# EAGLE design PiHatSandwich-v1 (EAGLE 7.4.0)
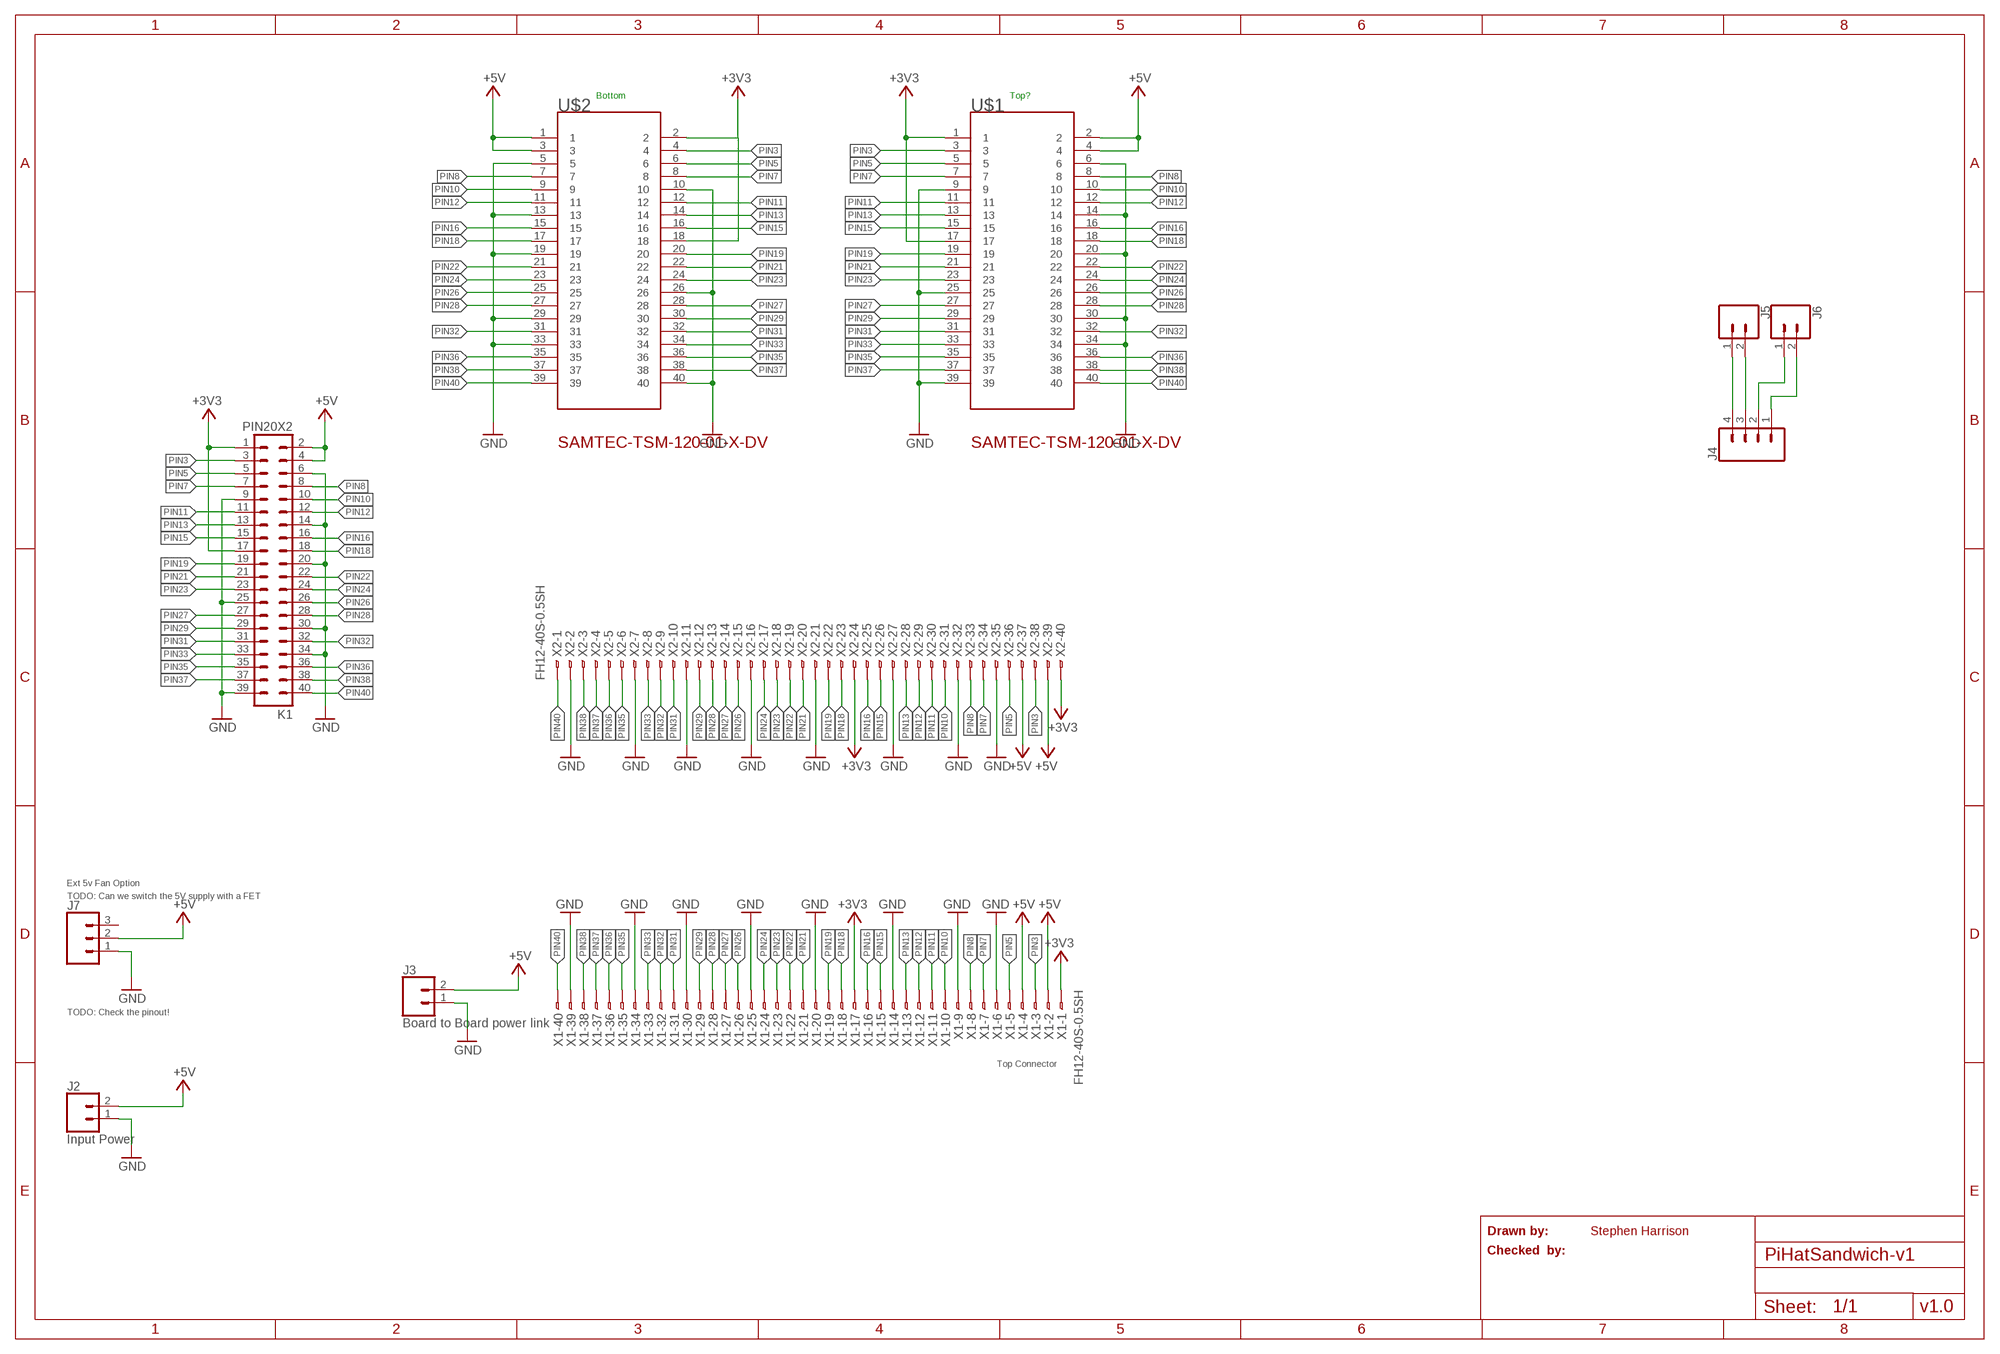
[diagram p0: schematic, sheet 1]

## Parts
J2  Input Power  CONN_02POLAR  [MOLEX-1X2]
J3  Board to Board power link  CONN_02POLAR  [MOLEX-1X2]
J4  CONN_04POLAR  [MOLEX-1X4]
J5  CONN_02  [1X02]
J6  CONN_02  [1X02]
J7  CONN_03POLAR  [MOLEX-1X3]
K1  PIN20X2  [PIN_20X2]
U$1  SAMTEC-TSM-120-01-X-DVJ  [SAMTEC-TSM-120-01-X-DV]
U$2  SAMTEC-TSM-120-01-X-DVJ  [SAMTEC-TSM-120-01-X-DV]
X1  FH12-40S-0.5SH  [FH12-40S-0.5SH]
X2  FH12-40S-0.5SH  [FH12-40S-0.5SH]

## Nets
+3V3: K1.1 K1.17 U$1.1 U$1.17 U$2.2 U$2.18 X1.1 X1.17 X2.24 X2.40
+5V: J2.2 J3.2 J7.2 K1.2 K1.4 U$1.2 U$1.4 U$2.1 U$2.3 X1.2 X1.4 X2.37 X2.39
GND: J2.1 J3.1 J7.1 K1.6 K1.9 K1.14 K1.20 K1.25 K1.30 K1.34 K1.39 U$1.6 U$1.9 U$1.14 U$1.20 U$1.25 U$1.30 U$1.34 U$1.39 U$2.5 U$2.10 U$2.13 U$2.19 U$2.26 U$2.29 U$2.33 U$2.40 X1.6 X1.9 X1.14 X1.20 X1.25 X1.30 X1.34 X1.39 X2.2 X2.7 X2.11 X2.16 X2.21 X2.27 X2.32 X2.35
N$4: J4.4 J5.1
N$5: J4.3 J5.2
N$6: J4.1 J6.2
N$7: J4.2 J6.1
PIN3: K1.3 U$1.3 U$2.4 X1.3 X2.38
PIN5: K1.5 U$1.5 U$2.6 X1.5 X2.36
PIN7: K1.7 U$1.7 U$2.8 X1.7 X2.34
PIN8: K1.8 U$1.8 U$2.7 X1.8 X2.33
PIN10: K1.10 U$1.10 U$2.9 X1.10 X2.31
PIN11: K1.11 U$1.11 U$2.12 X1.11 X2.30
PIN12: K1.12 U$1.12 U$2.11 X1.12 X2.29
PIN13: K1.13 U$1.13 U$2.14 X1.13 X2.28
PIN15: K1.15 U$1.15 U$2.16 X1.15 X2.26
PIN16: K1.16 U$1.16 U$2.15 X1.16 X2.25
PIN18: K1.18 U$1.18 U$2.17 X1.18 X2.23
PIN19: K1.19 U$1.19 U$2.20 X1.19 X2.22
PIN21: K1.21 U$1.21 U$2.22 X1.21 X2.20
PIN22: K1.22 U$1.22 U$2.21 X1.22 X2.19
PIN23: K1.23 U$1.23 U$2.24 X1.23 X2.18
PIN24: K1.24 U$1.24 U$2.23 X1.24 X2.17
PIN26: K1.26 U$1.26 U$2.25 X1.26 X2.15
PIN27: K1.27 U$1.27 U$2.28 X1.27 X2.14
PIN28: K1.28 U$1.28 U$2.27 X1.28 X2.13
PIN29: K1.29 U$1.29 U$2.30 X1.29 X2.12
PIN31: K1.31 U$1.31 U$2.32 X1.31 X2.10
PIN32: K1.32 U$1.32 U$2.31 X1.32 X2.9
PIN33: K1.33 U$1.33 U$2.34 X1.33 X2.8
PIN35: K1.35 U$1.35 U$2.36 X1.35 X2.6
PIN36: K1.36 U$1.36 U$2.35 X1.36 X2.5
PIN37: K1.37 U$1.37 U$2.38 X1.37 X2.4
PIN38: K1.38 U$1.38 U$2.37 X1.38 X2.3
PIN40: K1.40 U$1.40 U$2.39 X1.40 X2.1
Unconnected: J7.3

## Notes on the sheet
- Bottom | Top?
- Ext 5v Fan Option
- TODO: Can we switch the 5V supply with a FET
- TODO: Check the pinout!
- Top Connector
- Drawn by: | Stephen Harrison
- Checked  by:
- v1.0

## Library data of the parts
J2 J3 = SparkFun-Connectors:CONN_02: Multi connection point. Often used as Generic Header-pin footprint for 0.1 inch spaced/style header connections On any of the 0.1 inch spaced packages, you can populate with these: Break Away Headers - Straight <https://www.sparkfun.com/products/116> (PRT-00116) Break Away Male Headers - Right Angle <https://www.sparkfun.com/products/553> (PRT-00553) Female Headers <https://www.sparkfun.com/products/115> (PRT-00115) Break Away Headers - Machine Pin <https://www.sparkfun.com/products/117> (PRT-00117) Break Away Female Headers - Swiss Machine Pin <https://www.sparkfun.com/products/743> (PRT-00743) For SCREWTERMINALS and SPRING TERMINALS visit here: Screw Terimnals on SparkFun.com <https://www.sparkfun.com/search/results?term=Screw+Terminals> (5mm/3.5mm/2.54mm spacing) This device is also useful as a general connection point to wire up your design to another part of your project. Our various solder wires solder well into these plated through hole pads. Hook-Up Wire - Assortment (Stranded, 22 AWG) <https://www.sparkfun.com/products/11375> (PRT-11375) Hook-Up Wire - Assortment (Solid Core, 22 AWG) <https://www.sparkfun.com/products/11367> (PRT-11367) View the entire wire category on our website here <https://www.sparkfun.com/categories/141> Special notes: Molex polarized connector foot print use with: PRT-08233 with associated crimp pins and housings. 2.54_SCREWTERM for use with PRT-10571. 3.5mm Screw Terminal footprints for PRT-08084 5mm Screw Terminal footprints for use with PRT-08432; SF_ID: PRT-09918
J4 = SparkFun-Connectors:CONN_04: Multi connection point. Often used as Generic Header-pin footprint for 0.1 inch spaced/style header connections On any of the 0.1 inch spaced packages, you can populate with these: Break Away Headers - Straight <https://www.sparkfun.com/products/116> (PRT-00116) Break Away Male Headers - Right Angle <https://www.sparkfun.com/products/553> (PRT-00553) Female Headers <https://www.sparkfun.com/products/115> (PRT-00115) Break Away Headers - Machine Pin <https://www.sparkfun.com/products/117> (PRT-00117) Break Away Female Headers - Swiss Machine Pin <https://www.sparkfun.com/products/743> (PRT-00743) For SCREWTERMINALS and SPRING TERMINALS visit here: Screw Terimnals on SparkFun.com <https://www.sparkfun.com/search/results?term=Screw+Terminals> (5mm/3.5mm/2.54mm spacing) This device is also useful as a general connection point to wire up your design to another part of your project. Our various solder wires solder well into these plated through hole pads. Hook-Up Wire - Assortment (Stranded, 22 AWG) <https://www.sparkfun.com/products/11375> (PRT-11375) Hook-Up Wire - Assortment (Solid Core, 22 AWG) <https://www.sparkfun.com/products/11367> (PRT-11367) View the entire wire category on our website here <https://www.sparkfun.com/categories/141> Special notes: Molex polarized connector foot print use with SKU : PRT-08231 with associated crimp pins and housings. 1MM SMD Version SKU: PRT-10208; PROD_ID: CONN-08186; SF_ID: PRT-08231
J5 J6 = SparkFun-Connectors:CONN_02: Multi connection point. Often used as Generic Header-pin footprint for 0.1 inch spaced/style header connections On any of the 0.1 inch spaced packages, you can populate with these: Break Away Headers - Straight <https://www.sparkfun.com/products/116> (PRT-00116) Break Away Male Headers - Right Angle <https://www.sparkfun.com/products/553> (PRT-00553) Female Headers <https://www.sparkfun.com/products/115> (PRT-00115) Break Away Headers - Machine Pin <https://www.sparkfun.com/products/117> (PRT-00117) Break Away Female Headers - Swiss Machine Pin <https://www.sparkfun.com/products/743> (PRT-00743) For SCREWTERMINALS and SPRING TERMINALS visit here: Screw Terimnals on SparkFun.com <https://www.sparkfun.com/search/results?term=Screw+Terminals> (5mm/3.5mm/2.54mm spacing) This device is also useful as a general connection point to wire up your design to another part of your project. Our various solder wires solder well into these plated through hole pads. Hook-Up Wire - Assortment (Stranded, 22 AWG) <https://www.sparkfun.com/products/11375> (PRT-11375) Hook-Up Wire - Assortment (Solid Core, 22 AWG) <https://www.sparkfun.com/products/11367> (PRT-11367) View the entire wire category on our website here <https://www.sparkfun.com/categories/141> Special notes: Molex polarized connector foot print use with: PRT-08233 with associated crimp pins and housings. 2.54_SCREWTERM for use with PRT-10571. 3.5mm Screw Terminal footprints for PRT-08084 5mm Screw Terminal footprints for use with PRT-08432
J7 = SparkFun-Connectors:CONN_03: Multi connection point. Often used as Generic Header-pin footprint for 0.1 inch spaced/style header connections On any of the 0.1 inch spaced packages, you can populate with these: Break Away Headers - Straight <https://www.sparkfun.com/products/116> (PRT-00116) Break Away Male Headers - Right Angle <https://www.sparkfun.com/products/553> (PRT-00553) Female Headers <https://www.sparkfun.com/products/115> (PRT-00115) Break Away Headers - Machine Pin <https://www.sparkfun.com/products/117> (PRT-00117) Break Away Female Headers - Swiss Machine Pin <https://www.sparkfun.com/products/743> (PRT-00743) Stackable Header - 3 Pin (Female, 0.1") <https://www.sparkfun.com/products/13875> (PRT-13875) For SCREWTERMINALS and SPRING TERMINALS visit here: Screw Terimnals on SparkFun.com <https://www.sparkfun.com/search/results?term=Screw+Terminals> (5mm/3.5mm/2.54mm spacing) This device is also useful as a general connection point to wire up your design to another part of your project. Our various solder wires solder well into these plated through hole pads. Hook-Up Wire - Assortment (Stranded, 22 AWG) <https://www.sparkfun.com/products/11375> (PRT-11375) Hook-Up Wire - Assortment (Solid Core, 22 AWG) <https://www.sparkfun.com/products/11367> (PRT-11367) View the entire wire category on our website here <https://www.sparkfun.com/categories/141> Special notes: Molex polarized connector foot print use with SKU : PRT-08232 with associated crimp pins and housings.; PROD_ID: CONN-08625; SF_ID: PRT-08096
K1 = FLYFISH:PIN20X2
U$1 U$2 = SAMTEC-TSM-120-01-X-DV:SAMTEC-TSM-120-01-X-DV; AVAILABILITY: Unavailable; DESCRIPTION: Conn Unshrouded Header HDR 40 POS 2.54mm Solder ST SMD Tube; MF: Samtec; MP: TSM-120-01-S-DV-M; PACKAGE: None; PRICE: None
X1 X2 = con-hirose:FH12-40S-0.5S: 0.5mm Pitch Connectors For FPC/FFC Source: Data sheet <http://www.hirose.co.jp/cataloge_hp/e58605370.pdf>; MPN: FH12-40S-0.5SH(55); OC_FARNELL: 1324556; OC_NEWARK: 34M6178

## Board
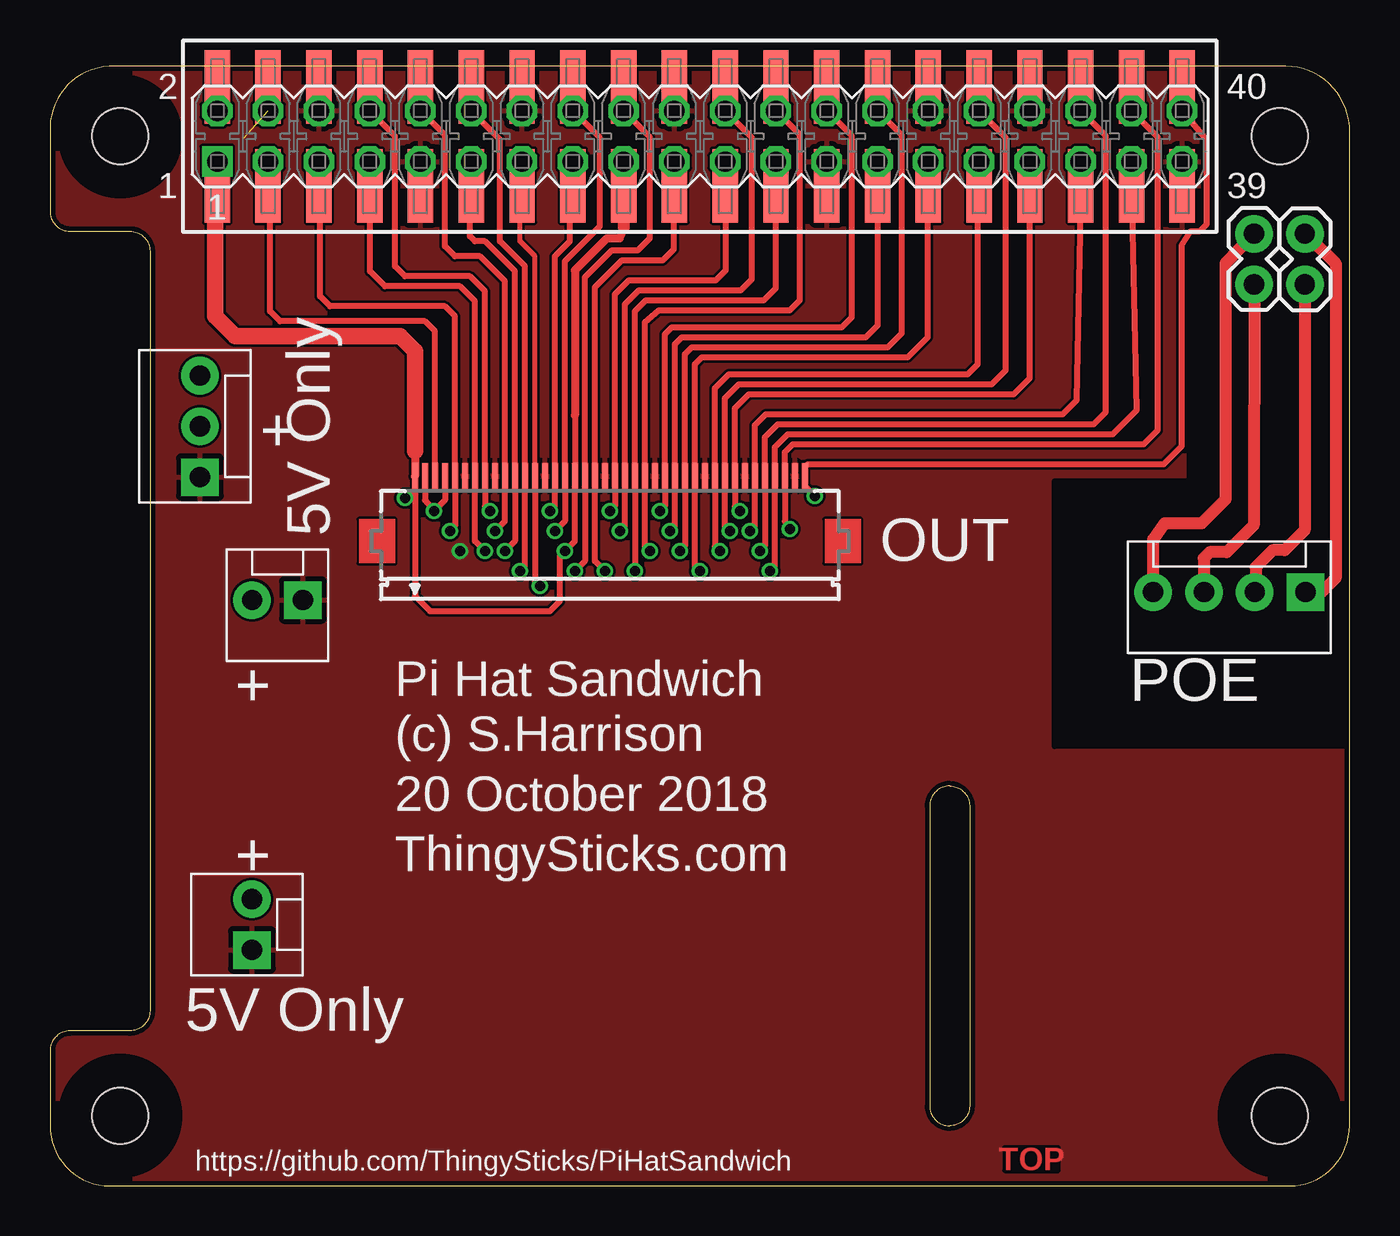
[diagram p1: board, top side]
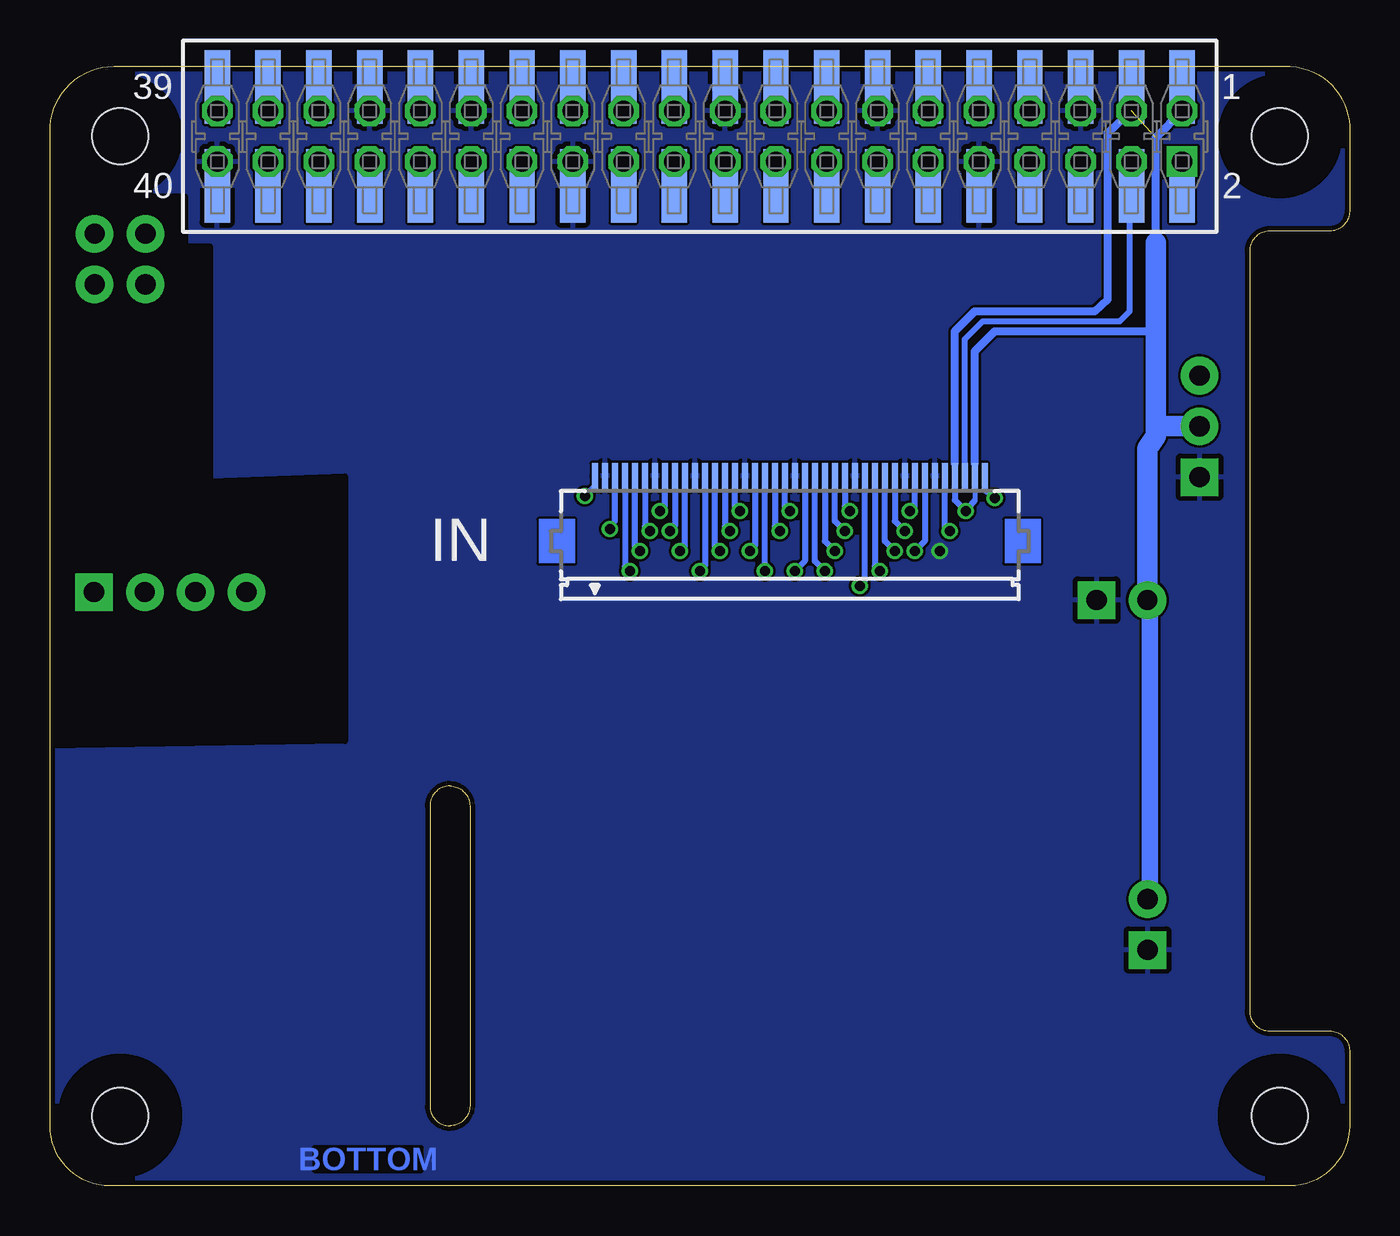
[diagram p2: board, bottom side, seen from below]

Size 65 x 56.01 mm. Coordinates in mm from the lower left corner, seen from the top.
Outline: 0,3 arc90 3,0 62,0 arc90 65,3 65,53 arc90 61.5,56 3.25,56 arc90 0,53 0,48.75 arc90 1,47.75 4,47.75 arc-90 5,46.75 5,8.75 arc-90 4,7.75 1,7.75 arc90 0,6.75 0,3
Outline: 44,19 44,4 arc90 45,3 arc90 46,4 46,19 arc90 45,20 arc90 44,19
Copper layers (1*16): Top 0.035mm / dielectric 1.5mm / Bottom 0.035mm
Design rules "dirt_cheap_dirty_boards.v1": minimum track width 5mil, minimum drill 12mil, track to track 5mil, track to pad 5mil, pad to pad 5mil, via to via 5mil, smd to smd 0mil, copper to edge 10mil, drill to drill 10mil, minimum pad ring 10mil, minimum via ring 6mil, stop-mask expansion 2mil, vias tented up to drill 25mil, thermal gap 10mil
Holes 2.8 mm at 3.5,3.5 3.5,52.5 61.5,52.5 61.5,3.5
tRestrict: area 1.9,51 to 5,54; area 60,51 to 63,54; area 60,1.9 to 63,5; area 1.9,1.9 to 5,5; area 50.2,22 to 65.2,49.8
bRestrict: area 1.9,1.9 to 5,5; area 1.9,51 to 5,54; area 60,1.9 to 63,5; area 60,51 to 63,54; area 50.2,22 to 65.2,49.5
Milling: 6 lines

### Footprints (pad centres in the part's own frame; a part is rotated, then mirrored left to right if it is on the bottom)
MOLEX-1X2 = drill 1.016 pad 1.88 square: 1 0,0 | drill 1.016 pad 1.88: 2 2.54,0
MOLEX-1X4 = drill 1.016 pad 1.88 square: 1 0,0 | drill 1.016 pad 1.88: 2 2.54,0; 3 5.08,0; 4 7.62,0
1X02 = drill 1.016 pad 1.88: 1 0,0; 2 2.54,0
MOLEX-1X3 = drill 1.016 pad 1.88 square: 1 0,0 | drill 1.016 pad 1.88: 2 2.54,0; 3 5.08,0
PIN_20X2 = drill 1.016 square: 1 -24.13,-1.27 | drill 1.016 octagon: 2 -24.13,1.27; 3 -21.59,-1.27; 4 -21.59,1.27; 5 -19.05,-1.27; 6 -19.05,1.27; 7 -16.51,-1.27; 8 -16.51,1.27; 9 -13.97,-1.27; 10 -13.97,1.27; 11 -11.43,-1.27; 12 -11.43,1.27; 13 -8.89,-1.27; 14 -8.89,1.27; 15 -6.35,-1.27; 16 -6.35,1.27; 17 -3.81,-1.27; 18 -3.81,1.27; 19 -1.27,-1.27; 20 -1.27,1.27; 21 1.27,-1.27; 22 1.27,1.27; 23 3.81,-1.27; 24 3.81,1.27; 25 6.35,-1.27; 26 6.35,1.27; 27 8.89,-1.27; 28 8.89,1.27; 29 11.43,-1.27; 30 11.43,1.27; 31 13.97,-1.27; 32 13.97,1.27; 33 16.51,-1.27; 34 16.51,1.27; 35 19.05,-1.27; 36 19.05,1.27; 37 21.59,-1.27; 38 21.59,1.27; 39 24.13,-1.27; 40 24.13,1.27
SAMTEC-TSM-120-01-X-DV = smd 1.27 x 3.68: 1 -24.13,-2.476; 2 -24.13,2.476; 3 -21.59,-2.476; 4 -21.59,2.476; 5 -19.05,-2.476; 6 -19.05,2.476; 7 -16.51,-2.476; 8 -16.51,2.476; 9 -13.97,-2.476; 10 -13.97,2.476; 11 -11.43,-2.476; 12 -11.43,2.476; 13 -8.89,-2.476; 14 -8.89,2.476; 15 -6.35,-2.476; 16 -6.35,2.476; 17 -3.81,-2.476; 18 -3.81,2.476; 19 -1.27,-2.476; 20 -1.27,2.476; 21 1.27,-2.476; 22 1.27,2.476; 23 3.81,-2.476; 24 3.81,2.476; 25 6.35,-2.476; 26 6.35,2.476; 27 8.89,-2.476; 28 8.89,2.476; 29 11.43,-2.476; 30 11.43,2.476; 31 13.97,-2.476; 32 13.97,2.476; 33 16.51,-2.476; 34 16.51,2.476; 35 19.05,-2.476; 36 19.05,2.476; 37 21.59,-2.476; 38 21.59,2.476; 39 24.13,-2.476; 40 24.13,2.476
FH12-40S-0.5SH = smd 0.3 x 1.3: 1 -9.75,3.25; 2 -9.25,3.25; 3 -8.75,3.25; 4 -8.25,3.25; 5 -7.75,3.25; 6 -7.25,3.25; 7 -6.75,3.25; 8 -6.25,3.25; 9 -5.75,3.25; 10 -5.25,3.25; 11 -4.75,3.25; 12 -4.25,3.25; 13 -3.75,3.25; 14 -3.25,3.25; 15 -2.75,3.25; 16 -2.25,3.25; 17 -1.75,3.25; 18 -1.25,3.25; 19 -0.75,3.25; 20 -0.25,3.25; 21 0.25,3.25; 22 0.75,3.25; 23 1.25,3.25; 24 1.75,3.25; 25 2.25,3.25; 26 2.75,3.25; 27 3.25,3.25; 28 3.75,3.25; 29 4.25,3.25; 30 4.75,3.25; 31 5.25,3.25; 32 5.75,3.25; 33 6.25,3.25; 34 6.75,3.25; 35 7.25,3.25; 36 7.75,3.25; 37 8.25,3.25; 38 8.75,3.25; 39 9.25,3.25; 40 9.75,3.25

### Placement (x,y rotation side)
J2  10.1,11.8 90 top
J3  12.65,29.3 180 top
J4  62.8,29.7 180 top
J5  60.23,47.62 270 top
J6  62.77,45.09 90 top
J7  7.5,35.45 90 top
K1  32.5,52.5 0 top
U$1  32.5,52.5 0 top
U$2  32.5,52.5 180 bottom
X1  28,32.25 0 top
X2  28,32.25 0 bottom

### Tracks (layer width: path | path; a pad name or v marks a point on that pad's centre or on a via)
+3V3  (via drill 0.5)
  Top 0.254: K1.1 8.4,51.23
  Top 0.305: v17.75,34.4 18.25,34.8 X2.40 18.25,29.5 19,28.75 25,28.75 25.5,29.25 25.5,31.5 v25.75,31.75 26.25,32.25 X1.17 26.25,38.55 | 8.25,51.11 8.25,50.14 U$2.2
  Top 0.406: 18.25,36.75 X2.40 | 26.25,38.55 26.25,45.8 27.85,47.4 28.5,47.4 28.7,47.85 28.7,47.93 28.69,47.94
  Top 0.61: K1.17 U$2.18 28.69,47.94
  Top 0.813: K1.1 8.25,51.11 8.25,43.5 9.25,42.5 17.5,42.5 18.25,41.75 18.25,36.75
  Bottom 0.305: v17.75,34.4 18.25,34.8 X2.40 | X1.17 26.25,32.25 v25.75,31.75
  Bottom 0.813: U$2.2 K1.1 | U$2.18 K1.17
+5V  (via drill 0.5)  (1 unrouted)
  Top 0.305: X2.39 18.75,34.3 v19.2,33.75 19.75,34.3 X2.37 | K1.4 U$2.3 | K1.2 U$2.1
  Bottom 0.254: 18.75,36.15 X2.39 18.75,34.3 | X2.37 19.75,36.15
  Bottom 0.305: 18.75,34.3 v19.2,33.75 19.75,34.3 X2.37
  Bottom 0.406: 18.75,36.15 18.75,41.75 17.75,42.75 9.75,42.75 | 9.7,47.19 9.7,52.44 K1.2 | 19.75,36.15 19.75,42.75 18.75,43.75 12.75,43.75 12.1,44.35 12.1,52.68 K1.4
  Bottom 0.813: J2.2 10,15.25 10,29.19 J3.2 | U$2.1 K1.2 | U$2.3 K1.4
  Bottom 1.016: 9.7,47.19 9.7,38 | 9.7,38 J7.2 | J3.2 10.11,36.89 9.7,37.5 9.7,38
GND  (via drill 0.5)
  other vias: 20.5,31.75
  pour Bottom: 0,3 arc90 3,0 62,0 arc90 65,3 65,53 arc90 61.5,56 3,56 arc90 0,53 0,48.75 arc90 1,47.75 4,47.75 arc-90 5,46.75 5,8.75 arc-90 4,7.75 1,7.75 arc90 0,6.75
  pour Top: 0,3 arc90 3,0 62,0 arc90 65,3 65,53 arc90 62,56 3,56 arc90 0,53 0,48.75 arc90 1,47.75 4,47.75 arc-90 5,46.75 5,8.75 arc-90 4,7.75 1,7.75 arc90 0,6.75
N$4
  Top 0.61: J4.4 55.18,32.33 55.75,33.15 57.6,33.15 58.8,34.35 58.8,46.15 J5.1
N$5
  Top 0.61: J5.2 60.2,33.05 58.85,31.7 58,31.7 57.7,31.4 57.7,29.72 J4.3
N$6
  Top 0.61: J4.1 63.6,29.7 64.3,30.4 64.3,46.15 63.26,47.19 J6.2
N$7
  Top 0.61: J6.1 62.75,32.8 61.75,31.8 61.15,31.8 60.3,30.95 60.3,29.74 J4.2
PIN3
  Top 0.254: K1.3
  Top 0.305: 11,50.11 11,43.75 11.5,43.25 18.75,43.25 19.25,42.75 X2.38 | K1.3 11,51.14 11,50.11 | 11,50.11 U$2.4
  Bottom 0.305: X2.38 19.25,42.35 18.35,43.25 11.5,43.25 11,43.75 11,50.75 11,51.14 K1.3
  Bottom 0.813: U$2.4 10.91,50.66 11,50.75
PIN5  (via drill 0.5)
  Top 0.305: 13.5,50.07 13.5,44.5 14,44 19.75,44 20.25,43.5 X2.36 20.25,33 v20,32.75 | K1.5 13.5,51.18 13.5,50.07 | 13.5,50.07 U$2.6
  Bottom 0.305: v20,32.75 20.25,33 X2.36
  Bottom 0.813: U$2.6 K1.5
PIN7  (via drill 0.5)
  Top 0.305: 16,50.03 16,45.75 16.75,45 20.5,45 21.25,44.25 X2.34 21.25,32.25 v21.75,31.75 | K1.7 16,50.03 | 16,50.03 U$2.8
  Bottom 0.305: X2.34 21.25,32.25 v21.75,31.75
  Bottom 0.813: U$2.8 K1.7
PIN8  (via drill 0.5)
  Top 0.305: U$2.7 K1.8 17.25,52.51 17.25,46 17.75,45.5 21,45.5 21.75,44.75 X2.33 21.75,34 v22,33.75
  Bottom 0.305: v22,33.75 21.75,34 X2.33
  Bottom 0.813: U$2.7 K1.8
PIN10  (via drill 0.5)
  Top 0.305: U$2.9 K1.10 19.75,52.55 19.75,47 20.25,46.5 21.5,46.5 22.75,45.25 X2.31 22.75,33.25 v22.25,32.75
  Bottom 0.305: X2.31 22.75,33.25 v22.25,32.75
  Bottom 0.813: U$2.9 K1.10
PIN11  (via drill 0.5)
  Top 0.305: 21.1,51.2 K1.11 21,51.16 21,50.09 | 21,50.09 21,47.5 21.25,47.25 21.75,47.25 23.25,45.75 X2.30 23.25,32.25 v22.75,31.75 | 21,50.09 U$2.12
  Bottom 0.305: v22.75,31.75 23.25,32.25 X2.30
  Bottom 0.813: U$2.12 K1.11
PIN12  (via drill 0.5)
  Top 0.305: U$2.11 K1.12 22.5,52.34 22.5,47.25 23.75,46 X2.29 23.75,31 v23.5,30.75
  Bottom 0.305: X2.29 23.75,31 v23.5,30.75
  Bottom 0.813: U$2.11 K1.12
PIN13  (via drill 0.5)
  Top 0.254: X2.28 24.25,46.5 23.5,47.25 23.5,50.13 | K1.13 23.5,51.12 23.5,50.13 | 23.5,50.13 U$2.14
  Top 0.305: X2.28 24.25,30.25 v24.5,30
  Bottom 0.254: U$2.14 K1.13
  Bottom 0.305: v24.5,30 24.25,30.25 X2.28
PIN15  (via drill 0.5)
  Top 0.305: 26.1,51.18 K1.15 26,51.08 26,50.17 | 26,50.17 26,47.25 25.25,46.5 X1.15 25.25,34 v25,33.75 | 26,50.17 U$2.16
  Bottom 0.305: X1.15 25.25,34 v25,33.75
  Bottom 0.813: U$2.16 K1.15
PIN16  (via drill 0.5)
  Top 0.305: U$2.15 K1.16 27.5,52.42 27.5,48 25.75,46.25 X1.16 25.75,33.25 v25.25,32.75
  Bottom 0.305: v25.25,32.75 25.75,33.25 X1.16
  Bottom 0.813: U$2.15 K1.16
PIN18  (via drill 0.5)
  Top 0.305: U$2.17 K1.18 30,52.46 30,47.4 29.4,46.8 28.1,46.8 26.75,45.45 X1.18 26.75,31.25 v26.25,30.75
  Bottom 0.305: v26.25,30.75 26.75,31.25 X1.18
  Bottom 0.813: U$2.17 K1.18
PIN19  (via drill 0.5)
  Top 0.305: 31.2,50.05 31.2,46.85 30.65,46.3 28.6,46.3 27.25,44.95 X1.19 27.25,31.25 v27.75,30.75 | K1.19 31.2,51.2 31.2,50.05 | 31.2,50.05 U$2.20
  Bottom 0.305: X1.19 27.25,31.25 v27.75,30.75
  Bottom 0.813: U$2.20 K1.19
PIN21  (via drill 0.5)
  Top 0.305: 33.8,50.05 33.8,45.8 33.3,45.3 28.95,45.3 28.25,44.6 X1.21 28.25,34 v28,33.75 | K1.21 33.8,51.2 33.8,50.05 | 33.8,50.05 U$2.22
  Bottom 0.305: v28,33.75 28.25,34 X1.21
  Bottom 0.813: U$2.22 K1.21
PIN22  (via drill 0.5)
  Top 0.305: U$2.21 K1.22 35.1,52.44 35.1,45.35 34.55,44.8 29.45,44.8 28.75,44.1 X1.22 28.75,33 v28.5,32.75
  Bottom 0.305: X1.22 28.75,33 v28.5,32.75
  Bottom 0.813: U$2.21 K1.22
PIN23  (via drill 0.5)
  Top 0.305: 36.3,50.03 36.3,44.9 35.7,44.3 29.8,44.3 29.25,43.75 X1.23 v29.25,30.75 | K1.23 36.3,50.03 | 36.3,50.03 U$2.24
  Bottom 0.305: v29.25,30.75 X1.23
  Bottom 0.813: U$2.24 K1.23
PIN24  (via drill 0.5)
  Top 0.305: U$2.23 K1.24 37.5,52.58 37.5,44.3 37,43.8 30.45,43.8 29.75,43.2 X1.24 29.75,32 v30,31.75
  Bottom 0.305: X1.24 29.75,32 v30,31.75
  Bottom 0.813: U$2.23 K1.24
PIN26  (via drill 0.5)
  Top 0.305: U$2.25 K1.26 40.1,52.52 40.1,43.45 39.6,42.95 31.1,42.95 30.75,42.6 X1.26 30.75,34 v30.5,33.75
  Bottom 0.305: v30.5,33.75 30.75,34 X1.26
  Bottom 0.813: U$2.25 K1.26
PIN27  (via drill 0.5)
  Top 0.305: 41.4,50.03 41.4,43.05 40.8,42.45 31.6,42.45 31.25,42.1 X1.27 31.25,33 v31,32.75 | K1.27 41.4,50.03 | 41.4,50.03 U$2.28
  Bottom 0.305: X1.27 31.25,33 v31,32.75
  Bottom 0.813: U$2.28 K1.27
PIN28  (via drill 0.5)
  Top 0.305: U$2.27 K1.28 42.6,52.56 42.6,42.65 41.9,41.95 32.1,41.95 31.75,41.6 X1.28 31.75,32 v31.5,31.75
  Bottom 0.305: v31.5,31.75 31.75,32 X1.28
  Bottom 0.813: U$2.27 K1.28
PIN29  (via drill 0.5)
  Top 0.305: 43.9,50.05 43.9,42.45 42.9,41.45 32.6,41.45 32.25,41.1 X1.29 32.25,31 v32.5,30.75 | K1.29 43.9,51.2 43.9,50.05 | 43.9,50.05 U$2.30
  Bottom 0.305: X1.29 32.25,31 v32.5,30.75
  Bottom 0.813: U$2.30 K1.29
PIN31  (via drill 0.5)
  Top 0.305: 46.4,50.09 46.4,41.1 45.9,40.6 33.95,40.6 33.25,39.9 X1.31 33.25,32 v33.5,31.75 | K1.31 46.4,51.16 46.4,50.09 | 46.4,50.09 U$2.32
  Bottom 0.305: v33.5,31.75 33.25,32 X1.31
  Bottom 0.813: U$2.32 K1.31
PIN32  (via drill 0.5)
  Top 0.305: U$2.31 K1.32 47.8,52.44 47.8,40.8 47.1,40.1 34.45,40.1 33.75,39.4 X1.32 33.75,33 v34,32.75
  Bottom 0.305: X1.32 33.75,33 v34,32.75
  Bottom 0.813: U$2.31 K1.32
PIN33  (via drill 0.5)
  Top 0.305: 49,50.03 49,40.4 48.2,39.6 34.95,39.6 34.25,38.9 X1.33 34.25,34 v34.5,33.75 | K1.33 49,50.03 | 49,50.03 U$2.34
  Bottom 0.305: v34.5,33.75 34.25,34 X1.33
  Bottom 0.813: U$2.34 K1.33
PIN35  (via drill 0.5)
  Top 0.305: 51.6,51.18 51.35,39.3 50.65,38.6 35.8,38.6 35.25,38.05 X1.35 35.25,33 v35,32.75 | 51.6,51.18 K1.35 | 51.6,51.18 51.6,50.07 U$2.36
  Bottom 0.305: X1.35 35.25,33 v35,32.75
  Bottom 0.813: U$2.36 K1.35
PIN36  (via drill 0.5)
  Top 0.305: U$2.35 K1.36 52.8,52.52 52.8,38.7 52.2,38.1 36.4,38.1 35.75,37.45 X1.36 35.75,32 v35.5,31.75
  Bottom 0.305: v35.5,31.75 35.75,32 X1.36
  Bottom 0.813: U$2.35 K1.36
PIN37  (via drill 0.5)
  Top 0.305: 54.1,50.03 54.35,38.8 53.15,37.6 36.9,37.6 36.25,36.95 X1.37 36.25,31 v36,30.75 | K1.37 54.1,50.03 | 54.1,50.03 U$2.38
  Bottom 0.305: X1.37 36.25,31 v36,30.75
  Bottom 0.813: U$2.38 K1.37
PIN38  (via drill 0.5)
  Top 0.305: U$2.37 K1.38 55.4,52.46 55.4,37.8 54.7,37.1 37.15,37.1 36.75,36.7 X1.38 36.75,33.25 v37,32.85
  Bottom 0.305: v37,32.85 36.75,33.25 X1.38
  Bottom 0.813: U$2.37 K1.38
PIN40  (via drill 0.5)
  Top 0.305: U$2.39 K1.40 57.85,52.3 57.85,48.1 57.5,47.75 57.05,47.75 56.6,47.05 56.6,37 55.7,36.1 37.9,36.1 37.75,35.95 X1.40 37.75,35 v38.25,34.5
  Bottom 0.305: X1.40 37.75,35 v38.25,34.5
  Bottom 0.813: U$2.39 K1.40

### Text on the board
Top: TOP
Bottom: BOTTOM
tNames: + | 5V Only | OUT | + | Pi Hat Sandwich | POE | (c) S.Harrison | 20 October 2018 | + | ThingySticks.com | 5V Only | https://github.com/ThingySticks/PiHatSandwich
bNames: IN